# EAGLE schematic motor_shield (EAGLE 9.2.1)
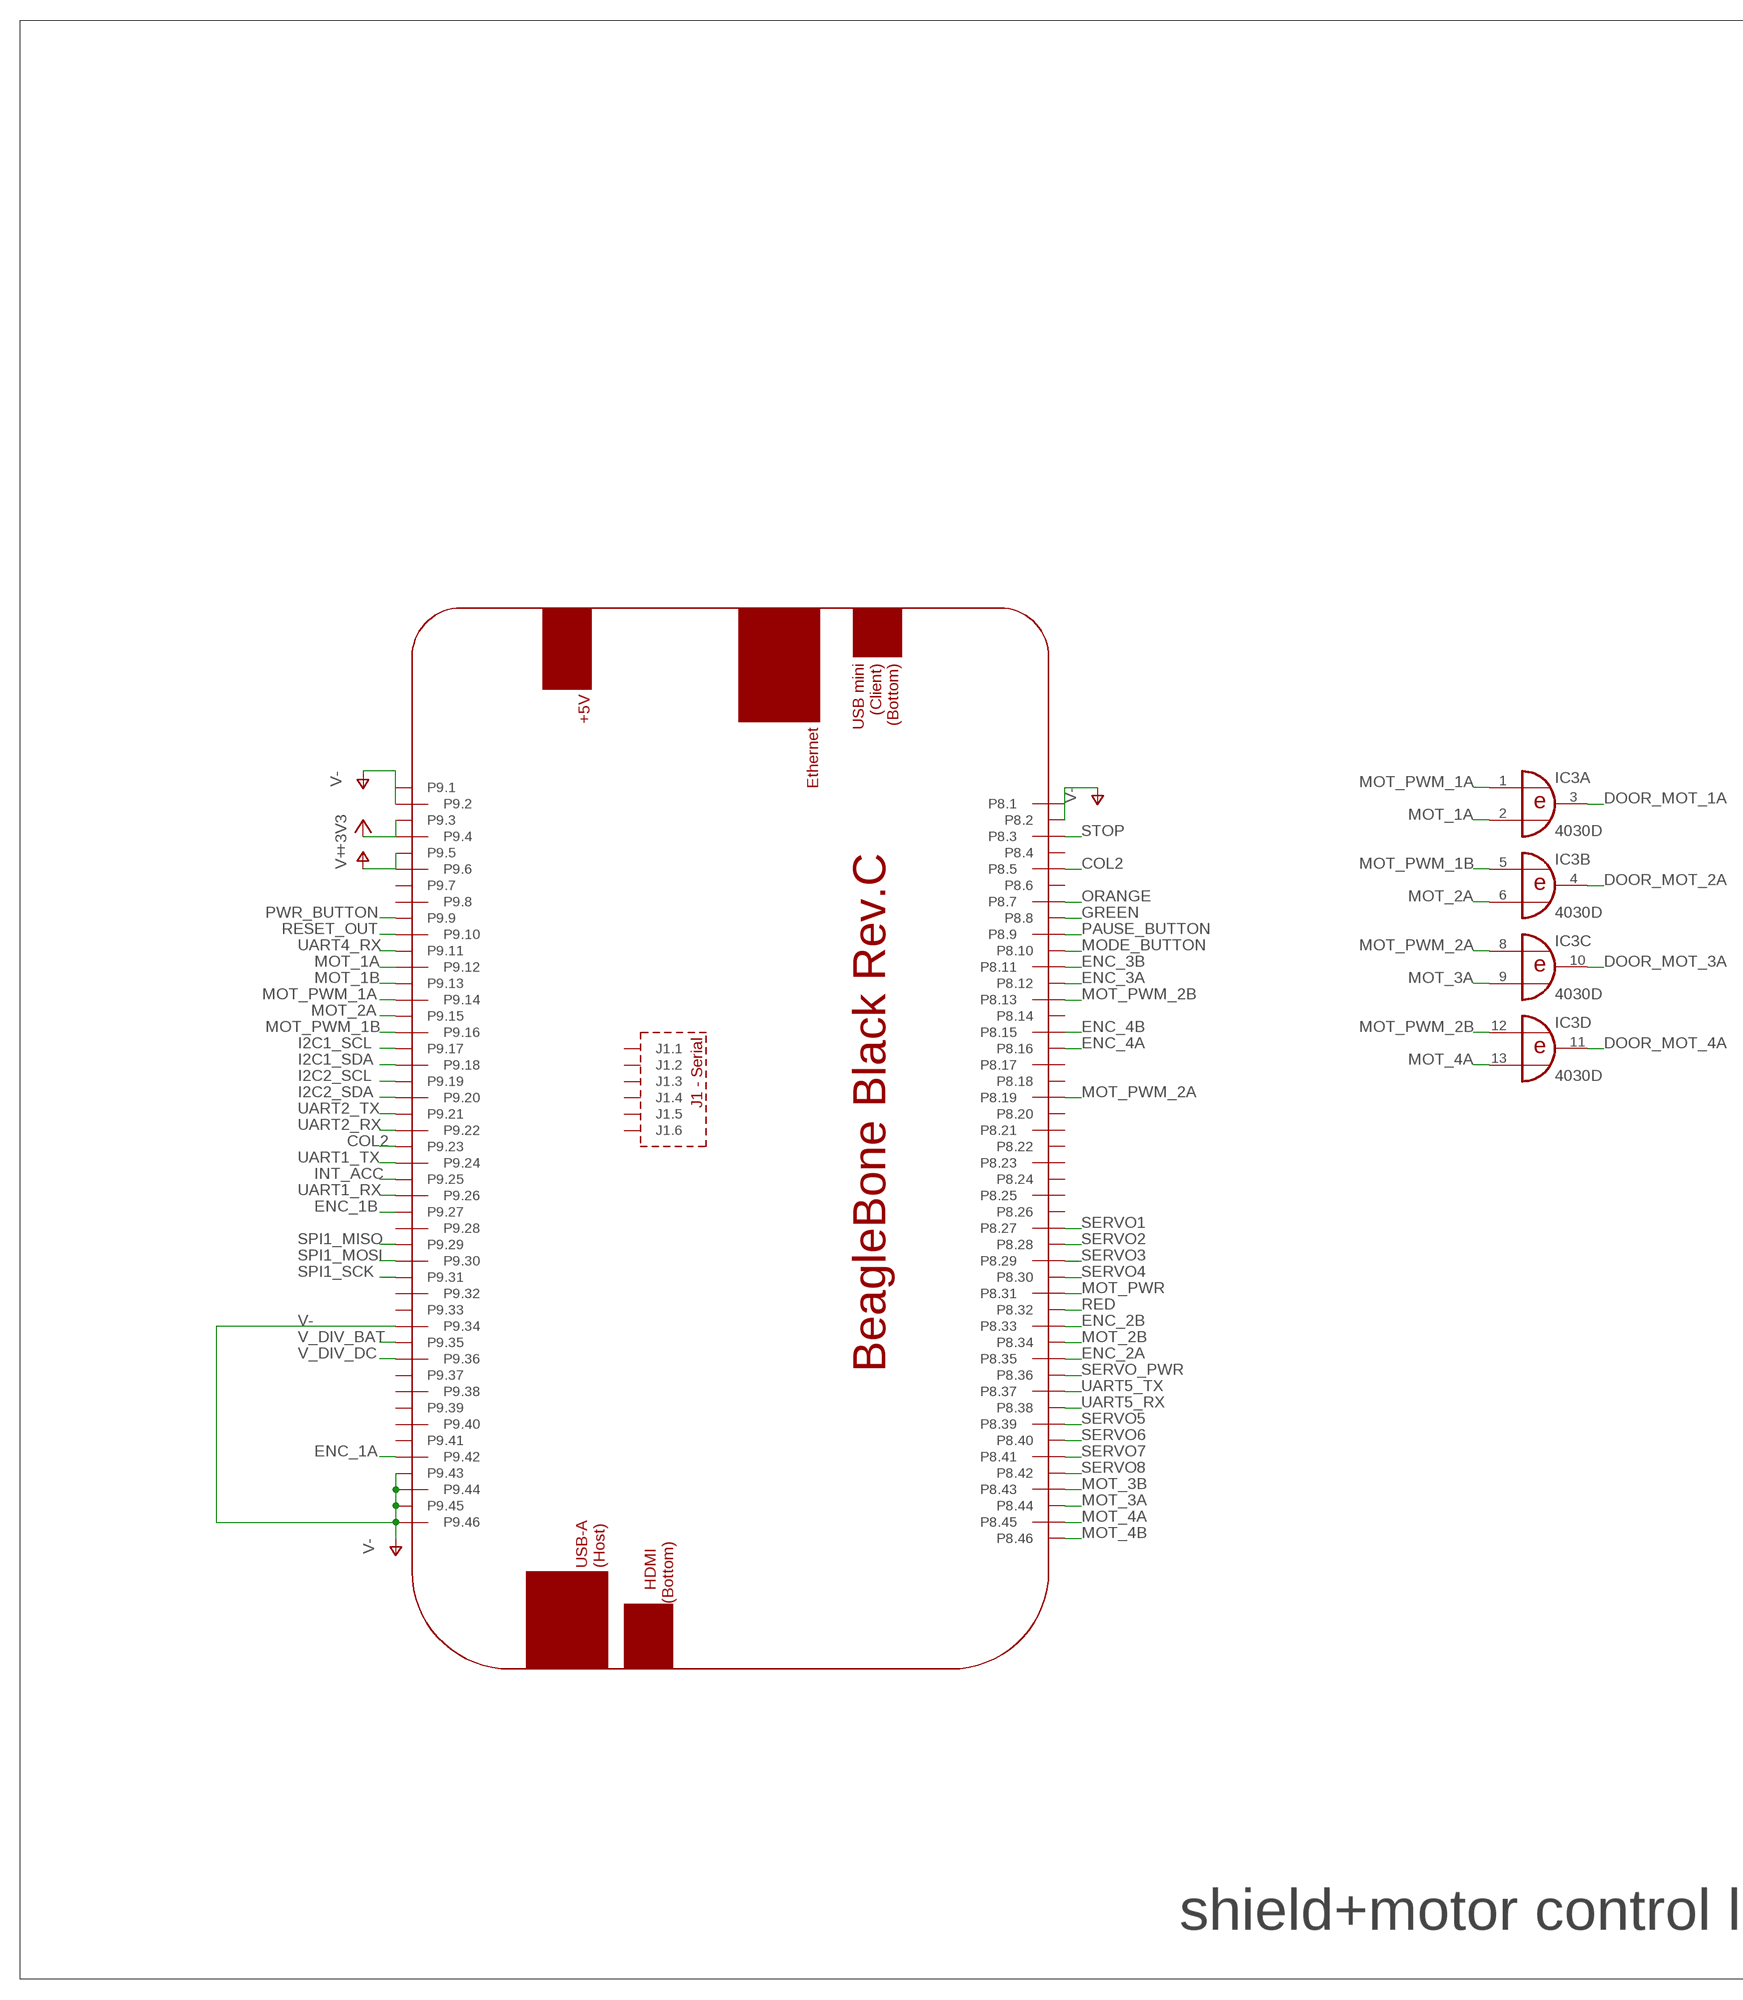
[diagram p0: schematic, sheet 1, part 1 of 3]
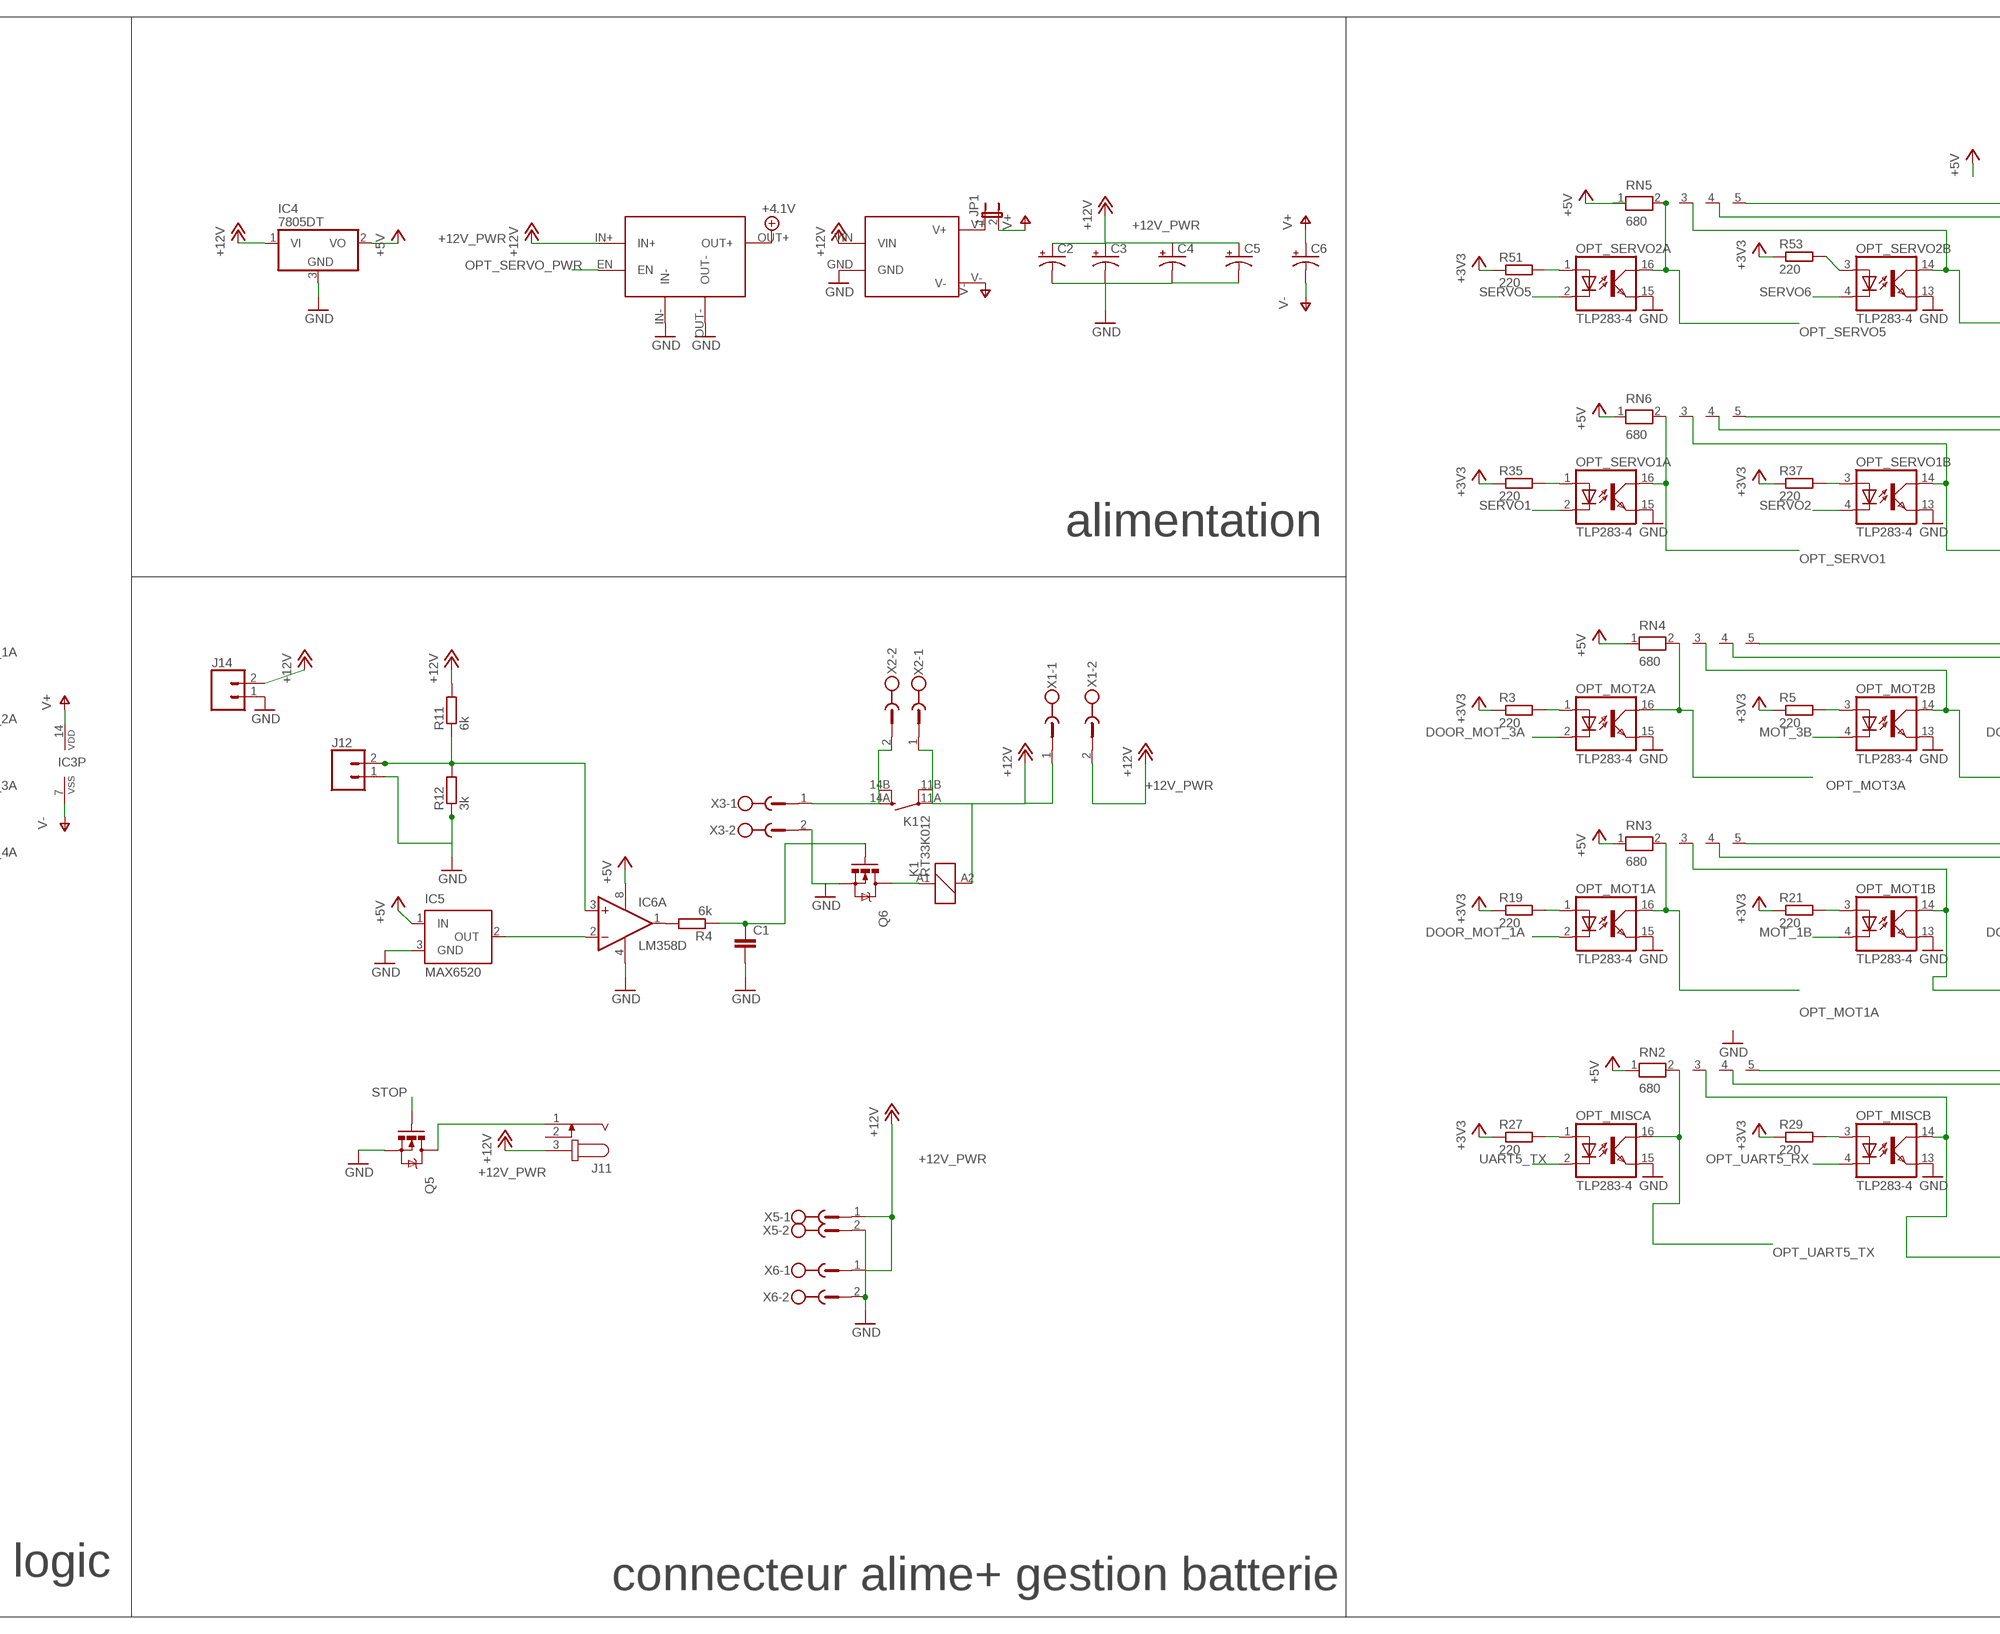
[diagram p1: schematic, sheet 1, part 2 of 3]
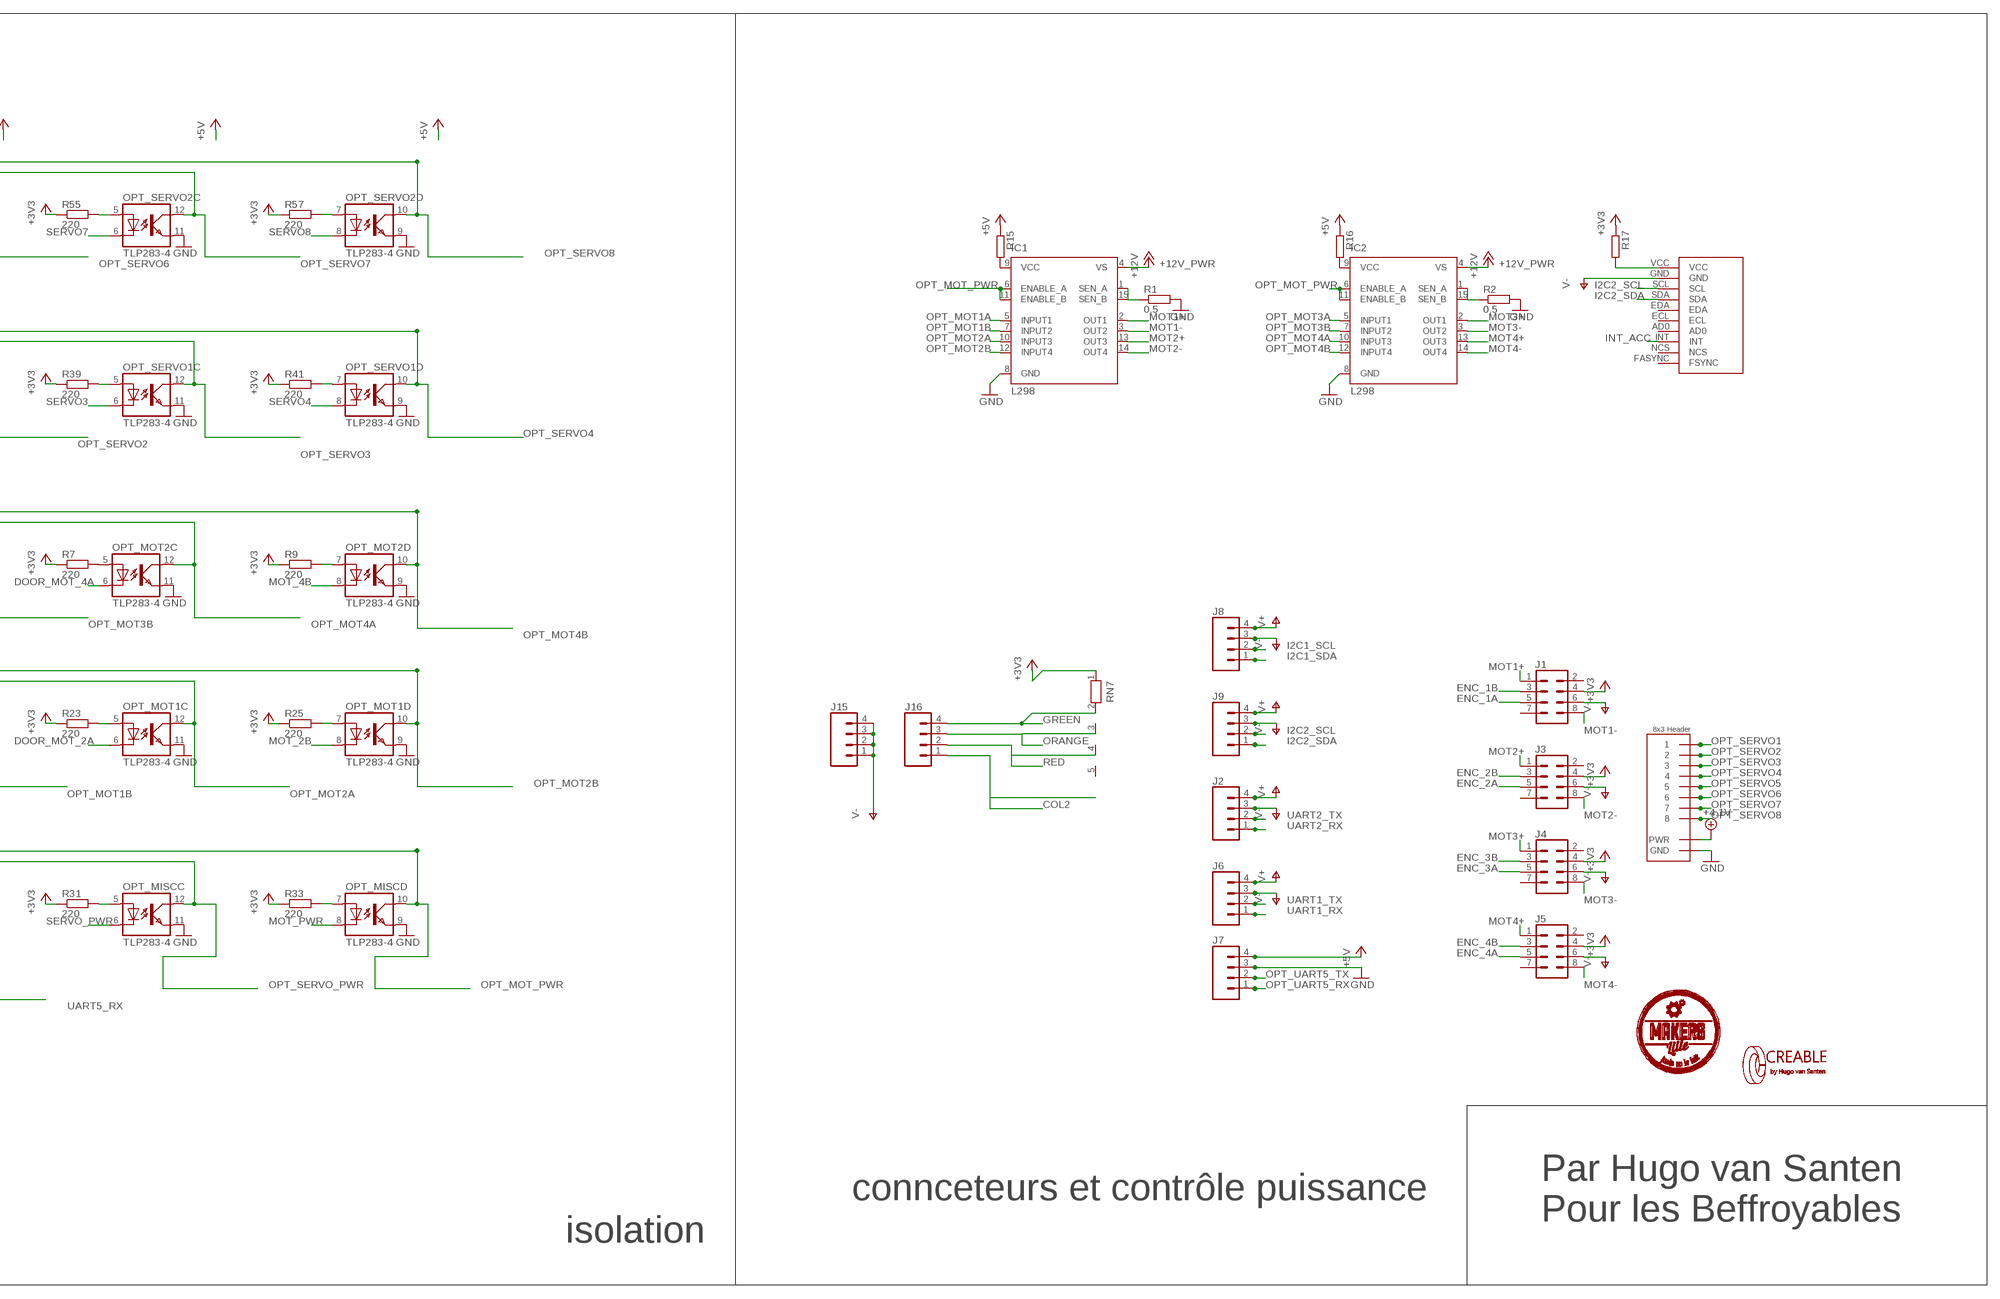
[diagram p2: schematic, sheet 1, part 3 of 3]

## Parts
C1  SPARKFUN-CAPACITORS_CAP0805  [SPARKFUN-CAPACITORS_0805]
C2  CPOL-US140CLH-1010  [ADAFRUIT_140CLH-1010]
C3  CPOL-US140CLH-1010  [ADAFRUIT_140CLH-1010]
C4  CPOL-US140CLH-1010  [ADAFRUIT_140CLH-1010]
C5  CPOL-US140CLH-1010  [ADAFRUIT_140CLH-1010]
C6  CPOL-US140CLH-1010  [ADAFRUIT_140CLH-1010]
IC1  L298  [MULTIWATT-15]
IC2  L298  [MULTIWATT-15]
IC3  4030D  [SO14]
IC4  7805DT  [TO252]
IC5  MAX6520  [SOT23]
IC6  LM358D  [SO08]
J1  CONN_04X2  [2X4]
J2  CONN_04POLAR  [MOLEX-1X4]
J3  CONN_04X2  [2X4]
J4  CONN_04X2  [2X4]
J5  CONN_04X2  [2X4]
J6  CONN_04POLAR  [MOLEX-1X4]
J7  CONN_04POLAR  [MOLEX-1X4]
J8  CONN_04POLAR  [MOLEX-1X4]
J9  CONN_04POLAR  [MOLEX-1X4]
J11  JACK-PLUG1  [SPC4078]
J12  CONN_02POLAR_LOCK  [MOLEX-1X2_LOCK]
J14  CONN_02POLAR_LOCK  [MOLEX-1X2_LOCK]
J15  CONN_04  [1X04]
J16  CONN_04  [1X04]
JP1  JP1E  [JP1]
K1  RT33K012  [RT-N/O16A5]
OPT_MISC  TLP283-4  [MINI-FLAT-16]
OPT_MOT1  TLP283-4  [MINI-FLAT-16]
OPT_MOT2  TLP283-4  [MINI-FLAT-16]
OPT_SERVO1  TLP283-4  [MINI-FLAT-16]
OPT_SERVO2  TLP283-4  [MINI-FLAT-16]
PCB1  BEAGLEBONE_BLACK_CAPE  [BEAGLEBONE_BLACK_CAPE]
Q5  STRAWSON_EAGLE_LIB_MOSFET-NCHANNEL  [STRAWSON_EAGLE_LIB_SO08-TIGHT]
Q6  STRAWSON_EAGLE_LIB_MOSFET-NCHANNEL  [STRAWSON_EAGLE_LIB_SO08-TIGHT]
R1  0.5  R-EU_M0805  [M0805]
R2  0.5  R-EU_M0805  [M0805]
R3  220  R-EU_M0805  [M0805]
R4  6k  R-EU_M0805  [M0805]
R5  220  R-EU_M0805  [M0805]
R7  220  R-EU_M0805  [M0805]
R9  220  R-EU_M0805  [M0805]
R11  6k  R-EU_M0805  [M0805]
R12  3k  R-EU_M0805  [M0805]
R15  R-EU_R0402  [R0402]
R16  R-EU_R0402  [R0402]
R17  R-EU_R0402  [R0402]
R19  220  R-EU_M0805  [M0805]
R21  220  R-EU_M0805  [M0805]
R23  220  R-EU_M0805  [M0805]
R25  220  R-EU_M0805  [M0805]
R27  220  R-EU_M0805  [M0805]
R29  220  R-EU_M0805  [M0805]
R31  220  R-EU_M0805  [M0805]
R33  220  R-EU_M0805  [M0805]
R35  220  R-EU_M0805  [M0805]
R37  220  R-EU_M0805  [M0805]
R39  220  R-EU_M0805  [M0805]
R41  220  R-EU_M0805  [M0805]
R51  220  R-EU_M0805  [M0805]
R53  220  R-EU_M0805  [M0805]
R55  220  R-EU_M0805  [M0805]
R57  220  R-EU_M0805  [M0805]
RN2  680  RN04  [RN-5]
RN3  680  RN04  [RN-5]
RN4  680  RN04  [RN-5]
RN5  680  RN04  [RN-5]
RN6  680  RN04  [RN-5]
RN7  RN04  [RN-5]
U$1  WRA-YMD  [WRA-YMD]
U$2  MPU9220  [MPU9250]
U$3  LOGO  [LOGO]
U$4  STRAWSON_EAGLE_LIB_SERVO_HEADERS_8X  [STRAWSON_EAGLE_LIB_3X8_0.1"_HEADER]
U$5  XL6009  [XL6009]
U$6  LOGO_MAKERS  [LOGO_MAKERS]
X1  MSTBV2  [MSTBV2]
X2  MSTBV2  [MSTBV2]
X3  MSTBV2  [MSTBV2]
X5  MSTBV2  [MSTBV2]
X6  MSTBV2  [MSTBV2]

## Nets
+3V3: J1.4 J3.4 J4.4 J5.4 PCB1.P9.3 PCB1.P9.4 R3.1 R5.1 R7.1 R9.1 R17.1 R19.1 R21.1 R23.1 R25.1 R27.1 R29.1 R31.1 R33.1 R35.1 R37.1 R39.1 R41.1 R51.1 R53.1 R55.1 R57.1 RN7.1
+4.1V: U$4.P$7(PWR) U$4.P$8(PWR) U$4.P$9(PWR) U$4.P$10(PWR) U$4.P$11(PWR) U$4.P$12(PWR) U$4.P$21(PWR) U$4.P$22(PWR) U$5.OUT+
+5V: IC4.2(VO) IC5.1(IN) IC6.8(P:V+) J7.4 R15.1 R16.1 RN2.1 RN3.1 RN4.1 RN5.1 RN6.1
+12V: IC4.1(VI) J14.2 K1.11A(2:PA) K1.11B(2:PB) K1.A2 R11.2 U$1.VIN X1.1 X2.1
+12V_PWR: C2.+ C3.+ C4.+ C5.+ IC1.4(VS) IC2.4(VS) J11.3 U$5.IN+ X1.2 X5.1 X6.1 ; supply symbol labelled +12V
COL2: J16.1 PCB1.P8.5 PCB1.P9.23
DOOR_MOT_1A: IC3.3(A:O) OPT_MOT1.2(A:C)
DOOR_MOT_2A: IC3.4(B:O) OPT_MOT1.6(C:C)
DOOR_MOT_3A: IC3.10(C:O) OPT_MOT2.2(A:C)
DOOR_MOT_4A: IC3.11(D:O) OPT_MOT2.6(C:C)
ENC_1A: J1.5 PCB1.P9.42
ENC_1B: J1.3 PCB1.P9.27
ENC_2A: J3.5 PCB1.P8.35
ENC_2B: J3.3 PCB1.P8.33
ENC_3A: J4.5 PCB1.P8.12
ENC_3B: J4.3 PCB1.P8.11
ENC_4A: J5.5 PCB1.P8.16
ENC_4B: J5.3 PCB1.P8.15
GND: C1.2 C2.- C3.- C4.- C5.- IC1.8(GND) IC2.8(GND) IC4.3(GND) IC5.3(GND) IC6.4(P:V-) J7.3 J12.1 J14.1 OPT_MISC.9(D:EMIT) OPT_MISC.11(C:EMIT) OPT_MISC.13(B:EMIT) OPT_MISC.15(A:EMIT) OPT_MOT1.9(D:EMIT) OPT_MOT1.11(C:EMIT) OPT_MOT1.13(B:EMIT) OPT_MOT1.15(A:EMIT) OPT_MOT2.9(D:EMIT) OPT_MOT2.11(C:EMIT) OPT_MOT2.13(B:EMIT) OPT_MOT2.15(A:EMIT) OPT_SERVO1.9(D:EMIT) OPT_SERVO1.11(C:EMIT) OPT_SERVO1.13(B:EMIT) OPT_SERVO1.15(A:EMIT) OPT_SERVO2.9(D:EMIT) OPT_SERVO2.11(C:EMIT) OPT_SERVO2.13(B:EMIT) OPT_SERVO2.15(A:EMIT) Q5.1(S) Q5.2(S) Q5.3(S) Q6.1(S) Q6.2(S) Q6.3(S) R1.2 R2.2 R12.1 U$1.GND U$4.P$13(GND) U$4.P$14(GND) U$4.P$15(GND) U$4.P$16(GND) U$4.P$17(GND) U$4.P$18(GND) U$4.P$23(GND) U$4.P$24(GND) U$5.IN- U$5.OUT- X3.2 X5.2 X6.2
GREEN: J16.4 PCB1.P8.8 RN7.2
I2C1_SCL: J8.2 PCB1.P9.17
I2C1_SDA: J8.1 PCB1.P9.18
I2C2_SCL: J9.2 PCB1.P9.19 U$2.SCL
I2C2_SDA: J9.1 PCB1.P9.20 U$2.SDA
INT_ACC: PCB1.P9.25 U$2.INT
MODE_BUTTON: PCB1.P8.10
MOT1+: IC1.2(OUT1) J1.1
MOT1-: IC1.3(OUT2) J1.8
MOT2+: IC1.13(OUT3) J3.1
MOT2-: IC1.14(OUT4) J3.8
MOT3+: IC2.2(OUT1) J4.1
MOT3-: IC2.3(OUT2) J4.8
MOT4+: IC2.13(OUT3) J5.1
MOT4-: IC2.14(OUT4) J5.8
MOT_1A: IC3.2(A:I1) PCB1.P9.12
MOT_1B: OPT_MOT1.4(B:C) PCB1.P9.13
MOT_2A: IC3.6(B:I1) PCB1.P9.15
MOT_2B: OPT_MOT1.8(D:C) PCB1.P8.34
MOT_3A: IC3.9(C:I1) PCB1.P8.44
MOT_3B: OPT_MOT2.4(B:C) PCB1.P8.43
MOT_4A: IC3.13(D:I1) PCB1.P8.45
MOT_4B: OPT_MOT2.8(D:C) PCB1.P8.46
MOT_PWM_1A: IC3.1(A:I0) PCB1.P9.14
MOT_PWM_1B: IC3.5(B:I0) PCB1.P9.16
MOT_PWM_2A: IC3.8(C:I0) PCB1.P8.19
MOT_PWM_2B: IC3.12(D:I0) PCB1.P8.13
MOT_PWR: OPT_MISC.8(D:C) PCB1.P8.31
N$1: OPT_SERVO2.1(A:A) R51.2
N$2: OPT_SERVO2.3(B:A) R53.2
N$3: OPT_MISC.1(A:A) R27.2
N$5: IC1.1(SEN_A) IC1.15(SEN_B) R1.1
N$6: IC2.1(SEN_A) IC2.15(SEN_B) R2.1
N$7: OPT_SERVO2.7(D:A) R57.2
N$8: OPT_SERVO1.1(A:A) R35.2
N$9: OPT_MOT2.5(C:A) R7.2
N$10: J11.1 Q5.5(D) Q5.6(D) Q5.7(D) Q5.8(D)
N$11: OPT_SERVO1.3(B:A) R37.2
N$12: OPT_SERVO1.7(D:A) R41.2
N$13: OPT_MOT2.1(A:A) R3.2
N$14: OPT_MOT2.3(B:A) R5.2
N$15: OPT_MOT2.7(D:A) R9.2
N$16: OPT_MOT1.3(B:A) R21.2
N$17: OPT_MOT1.1(A:A) R19.2
N$18: OPT_MOT1.7(D:A) R25.2
N$26: OPT_MOT1.5(C:A) R23.2
N$42: OPT_SERVO1.5(C:A) R39.2
N$51: OPT_MISC.3(B:A) R29.2
N$52: OPT_MISC.7(D:A) R33.2
N$58: OPT_SERVO2.5(C:A) R55.2
N$64: IC5.2(OUT) IC6.2(A:-IN)
N$69: OPT_MISC.5(C:A) R31.2
N$73: IC6.1(A:OUT) R4.2
N$74: K1.14A(2:SA) K1.14B(2:SB) X2.2 X3.1
N$75: K1.A1 Q6.5(D) Q6.6(D) Q6.7(D) Q6.8(D)
N$76: IC6.3(A:+IN) J12.2 R11.1 R12.2
N$77: C1.1 Q6.4(G) R4.1
N$78: JP1.1 U$1.V+
N$84: IC1.9(VCC) R15.2
N$85: IC2.9(VCC) R16.2
N$86: R17.2 U$2.VCC
OPT_MOT1A: IC1.5(INPUT1) OPT_MOT1.16(A:COL) RN3.2
OPT_MOT1B: IC1.7(INPUT2) OPT_MOT1.14(B:COL) RN3.3
OPT_MOT2A: IC1.10(INPUT3) OPT_MOT1.12(C:COL) RN3.4
OPT_MOT2B: IC1.12(INPUT4) OPT_MOT1.10(D:COL) RN3.5
OPT_MOT3A: IC2.5(INPUT1) OPT_MOT2.16(A:COL) RN4.2
OPT_MOT3B: IC2.7(INPUT2) OPT_MOT2.14(B:COL) RN4.3
OPT_MOT4A: IC2.10(INPUT3) OPT_MOT2.12(C:COL) RN4.4
OPT_MOT4B: IC2.12(INPUT4) OPT_MOT2.10(D:COL) RN4.5
OPT_MOT_PWR: IC1.6(ENABLE_A) IC1.11(ENABLE_B) IC2.6(ENABLE_A) IC2.11(ENABLE_B) OPT_MISC.10(D:COL) RN2.5
OPT_SERVO1: OPT_SERVO1.16(A:COL) RN6.2 U$4.P$1
OPT_SERVO2: OPT_SERVO1.14(B:COL) RN6.3 U$4.P$2
OPT_SERVO3: OPT_SERVO1.12(C:COL) RN6.4 U$4.P$3
OPT_SERVO4: OPT_SERVO1.10(D:COL) RN6.5 U$4.P$4
OPT_SERVO5: OPT_SERVO2.16(A:COL) RN5.2 U$4.P$5
OPT_SERVO6: OPT_SERVO2.14(B:COL) RN5.3 U$4.P$6
OPT_SERVO7: OPT_SERVO2.12(C:COL) RN5.4 U$4.P$19
OPT_SERVO8: OPT_SERVO2.10(D:COL) RN5.5 U$4.P$20
OPT_SERVO_PWR: OPT_MISC.12(C:COL) RN2.4 U$5.EN
OPT_UART5_RX: J7.1 OPT_MISC.4(B:C)
OPT_UART5_TX: J7.2 OPT_MISC.16(A:COL) RN2.2
ORANGE: J16.3 PCB1.P8.7 RN7.3
PAUSE_BUTTON: PCB1.P8.9
PWR_BUTTON: PCB1.P9.9
RED: J16.2 PCB1.P8.32 RN7.4
RESET_OUT: PCB1.P9.10
SERVO1: OPT_SERVO1.2(A:C) PCB1.P8.27
SERVO2: OPT_SERVO1.4(B:C) PCB1.P8.28
SERVO3: OPT_SERVO1.6(C:C) PCB1.P8.29
SERVO4: OPT_SERVO1.8(D:C) PCB1.P8.30
SERVO5: OPT_SERVO2.2(A:C) PCB1.P8.39
SERVO6: OPT_SERVO2.4(B:C) PCB1.P8.40
SERVO7: OPT_SERVO2.6(C:C) PCB1.P8.41
SERVO8: OPT_SERVO2.8(D:C) PCB1.P8.42
SERVO_PWR: OPT_MISC.6(C:C) PCB1.P8.36
SPI1_MISO: PCB1.P9.29
SPI1_MOSI: PCB1.P9.30
SPI1_SCK: PCB1.P9.31
STOP: PCB1.P8.3 Q5.4(G)
UART1_RX: J6.1 PCB1.P9.26
UART1_TX: J6.2 PCB1.P9.24
UART2_RX: J2.1 PCB1.P9.22
UART2_TX: J2.2 PCB1.P9.21
UART4_RX: PCB1.P9.11
UART5_RX: OPT_MISC.14(B:COL) PCB1.P8.38 RN2.3
UART5_TX: OPT_MISC.2(A:C) PCB1.P8.37
V+: C6.+ IC3.14(P:VDD) J2.4 J6.4 J8.4 J9.4 JP1.2 PCB1.P9.5 PCB1.P9.6
V-: C6.- IC3.7(P:VSS) J1.6 J2.3 J3.6 J4.6 J5.6 J6.3 J8.3 J9.3 J15.1 J15.2 J15.3 J15.4 PCB1.P8.1 PCB1.P8.2 PCB1.P9.1 PCB1.P9.2 PCB1.P9.34 PCB1.P9.43 PCB1.P9.44 PCB1.P9.45 PCB1.P9.46 U$1.V- U$2.GND
V_DIV_BAT: PCB1.P9.35
V_DIV_DC: PCB1.P9.36
Unconnected: IC6.5(B:+IN) IC6.6(B:-IN) IC6.7(B:OUT) J1.2 J1.7 J3.2 J3.7 J4.2 J4.7 J5.2 J5.7 J11.2 PCB1.J1.1 PCB1.J1.2 PCB1.J1.3 PCB1.J1.4 PCB1.J1.5 PCB1.J1.6 PCB1.P8.4 PCB1.P8.6 PCB1.P8.14 PCB1.P8.17 PCB1.P8.18 PCB1.P8.20 PCB1.P8.21 PCB1.P8.22 PCB1.P8.23 PCB1.P8.24 PCB1.P8.25 PCB1.P8.26 PCB1.P9.7 PCB1.P9.8 PCB1.P9.28 PCB1.P9.32 PCB1.P9.33 PCB1.P9.37 PCB1.P9.38 PCB1.P9.39 PCB1.P9.40 PCB1.P9.41 RN7.5 U$2.AD0 U$2.ECL U$2.EDA U$2.FASYNC(FSYNC) U$2.NCS

## Notes on the sheet
- alimentation
- connceteurs et contrôle puissance
- Par Hugo van Santen
  Pour les Beffroyables
- shield+motor control logic | isolation
- connecteur alime+ gestion batterie

## Library data of the parts
C1 = BeagleBone_Blue:SPARKFUN-CAPACITORS_CAP: Capacitor Standard 0603 ceramic capacitor, and 0.1" leaded capacitor.
C2-C6 = BeagleBone_Blue:CPOL-US: POLARIZED CAPACITOR, American symbol
IC1 IC2 = st-microelectronics:L298: DUAL FULL-BRIDGE DRIVER; MPN: L298N; OC_FARNELL: 1589425; OC_NEWARK: 32M1527
IC3 = 40xx:4030: Quad XOR
IC4 = linear:78*: Positive VOLTAGE REGULATOR Source: http://cache.national.com/ds/LM/LM78L05.pdf http://www.fairchildsemi.com/ds/LM/LM7805.pdf
IC5 = maxim:MAX6520: 1.2V Voltage Reference 50ppm/°C, SOT23, 3-Terminal Source: Data sheet <http://datasheets.maxim-ic.com/en/ds/MAX6520.pdf>; MF: MAXIM; MPN: MAX6520EUR-T; OC_FARNELL: unknown; OC_NEWARK: 02J4586
IC6 = linear:LM358: OP AMP also LM158; LM258; LM2904 Source: http://cache.national.com/ds/LM/LM158.pdf
J1 J3-J5 = SparkFun-Connectors:CONN_04X2: Multi connection point. Often used as Generic Header-pin footprint for 0.1 inch spaced/style header connections On any of the 0.1 inch spaced packages, you can populate with these: Break Away Headers - Straight <https://www.sparkfun.com/products/116> (PRT-00116) Break Away Male Headers - Right Angle <https://www.sparkfun.com/products/553> (PRT-00553) Female Headers <https://www.sparkfun.com/products/115> (PRT-00115) Break Away Headers - Machine Pin <https://www.sparkfun.com/products/117> (PRT-00117) Break Away Female Headers - Swiss Machine Pin <https://www.sparkfun.com/products/743> (PRT-00743)
J2 J6-J9 = SparkFun-Connectors:CONN_04: Multi connection point. Often used as Generic Header-pin footprint for 0.1 inch spaced/style header connections On any of the 0.1 inch spaced packages, you can populate with these: Break Away Headers - Straight <https://www.sparkfun.com/products/116> (PRT-00116) Break Away Male Headers - Right Angle <https://www.sparkfun.com/products/553> (PRT-00553) Female Headers <https://www.sparkfun.com/products/115> (PRT-00115) Break Away Headers - Machine Pin <https://www.sparkfun.com/products/117> (PRT-00117) Break Away Female Headers - Swiss Machine Pin <https://www.sparkfun.com/products/743> (PRT-00743) For SCREWTERMINALS and SPRING TERMINALS visit here: Screw Terimnals on SparkFun.com <https://www.sparkfun.com/search/results?term=Screw+Terminals> (5mm/3.5mm/2.54mm spacing) This device is also useful as a general connection point to wire up your design to another part of your project. Our various solder wires solder well into these plated through hole pads. Hook-Up Wire - Assortment (Stranded, 22 AWG) <https://www.sparkfun.com/products/11375> (PRT-11375) Hook-Up Wire - Assortment (Solid Core, 22 AWG) <https://www.sparkfun.com/products/11367> (PRT-11367) View the entire wire category on our website here <https://www.sparkfun.com/categories/141> Special notes: Molex polarized connector foot print use with SKU : PRT-08231 with associated crimp pins and housings. 1MM SMD Version SKU: PRT-10208; PROD_ID: CONN-08186; SF_ID: PRT-08231
J11 = con-jack:JACK-PLUG: DC POWER JACK Power Jack, DC, Right Angle, Through Hole, Rated 5A at 16VDC, PC Terminals Distributor: Farnell (www.Farnell.de) Drawing: 84N1161.pdf / 84N1162.pdf Manufacturer: SPC Technology (www.spctechnology.com) Type: SPC4077 / SPC 4078; OC_FARNELL: unknown; OC_NEWARK: unknown
J12 J14 = SparkFun-Connectors:CONN_02: Multi connection point. Often used as Generic Header-pin footprint for 0.1 inch spaced/style header connections On any of the 0.1 inch spaced packages, you can populate with these: Break Away Headers - Straight <https://www.sparkfun.com/products/116> (PRT-00116) Break Away Male Headers - Right Angle <https://www.sparkfun.com/products/553> (PRT-00553) Female Headers <https://www.sparkfun.com/products/115> (PRT-00115) Break Away Headers - Machine Pin <https://www.sparkfun.com/products/117> (PRT-00117) Break Away Female Headers - Swiss Machine Pin <https://www.sparkfun.com/products/743> (PRT-00743) For SCREWTERMINALS and SPRING TERMINALS visit here: Screw Terimnals on SparkFun.com <https://www.sparkfun.com/search/results?term=Screw+Terminals> (5mm/3.5mm/2.54mm spacing) This device is also useful as a general connection point to wire up your design to another part of your project. Our various solder wires solder well into these plated through hole pads. Hook-Up Wire - Assortment (Stranded, 22 AWG) <https://www.sparkfun.com/products/11375> (PRT-11375) Hook-Up Wire - Assortment (Solid Core, 22 AWG) <https://www.sparkfun.com/products/11367> (PRT-11367) View the entire wire category on our website here <https://www.sparkfun.com/categories/141> Special notes: Molex polarized connector foot print use with: PRT-08233 with associated crimp pins and housings. 2.54_SCREWTERM for use with PRT-10571. 3.5mm Screw Terminal footprints for PRT-08084 5mm Screw Terminal footprints for use with PRT-08432; SF_ID: PRT-09918
J15 J16 = SparkFun-Connectors:CONN_04: Multi connection point. Often used as Generic Header-pin footprint for 0.1 inch spaced/style header connections On any of the 0.1 inch spaced packages, you can populate with these: Break Away Headers - Straight <https://www.sparkfun.com/products/116> (PRT-00116) Break Away Male Headers - Right Angle <https://www.sparkfun.com/products/553> (PRT-00553) Female Headers <https://www.sparkfun.com/products/115> (PRT-00115) Break Away Headers - Machine Pin <https://www.sparkfun.com/products/117> (PRT-00117) Break Away Female Headers - Swiss Machine Pin <https://www.sparkfun.com/products/743> (PRT-00743) For SCREWTERMINALS and SPRING TERMINALS visit here: Screw Terimnals on SparkFun.com <https://www.sparkfun.com/search/results?term=Screw+Terminals> (5mm/3.5mm/2.54mm spacing) This device is also useful as a general connection point to wire up your design to another part of your project. Our various solder wires solder well into these plated through hole pads. Hook-Up Wire - Assortment (Stranded, 22 AWG) <https://www.sparkfun.com/products/11375> (PRT-11375) Hook-Up Wire - Assortment (Solid Core, 22 AWG) <https://www.sparkfun.com/products/11367> (PRT-11367) View the entire wire category on our website here <https://www.sparkfun.com/categories/141> Special notes: Molex polarized connector foot print use with SKU : PRT-08231 with associated crimp pins and housings. 1MM SMD Version SKU: PRT-10208; PROD_ID: CONN-09696
JP1 = jumper:JP1E: JUMPER
K1 = relay:RT33*: Power PCB Relay Inrush SCHRACK 1 pole 16 A, for inrush peak currents up to 80 A Source: http://www.schrack.com/.. 5825.pdf; MPN: RT33K012; OC_FARNELL: unknown; OC_NEWARK: 48M7964
OPT_MISC OPT_MOT1 OPT_MOT2 OPT_SERVO1 OPT_SERVO2 = optocoupler:TLP283-4: TOSHIBA PHOTOCOUPLER GaAs IRED & PHOTO-TRANSISTOR Source: http://www.semicon.toshiba.co.jp/td/en/Opto/Photocoupler/en_20050928_TLP283_datasheet.pdf; OC_FARNELL: unknown; OC_NEWARK: unknown
PCB1 = e14_BeagleBoneBlack_RevB:BEAGLEBONE_BLACK_CAPE
Q5 Q6 = BeagleBone_Blue:STRAWSON_EAGLE_LIB_MOSFET-NCHANNEL: Common NMOSFET Parts MFG P/N Store ID Prod ID FDD8780 TRANS-09984 SI7820DN TRANS-11055 FDS6630A IC-08089 2N7002PW TRANS-11151 FQP30N06L COM-10213 TRANS-10060 BSS123LT1G TRANS-08345 BSS138 TRANS-00830 BS170 2N7000
R1-R5 R7 R9 R11 R12 R19 R21 R23 R25 R27 R29 R31 R33 R35 R37 R39 R41 R51 R53 R55 R57 = rcl:R-EU_: RESISTOR, European symbol; SPICEPREFIX: R
R15-R17 = resistor:R-EU_: RESISTOR, European symbol
RN2-RN7 = resistor-net:RN04: RESISTOR NETWORK; OC_FARNELL: unknown; OC_NEWARK: unknown
U$1 = beffroyables:WRA-YMD
U$2 = beffroyables:MPU9220
U$3 = beffroyables:LOGO
U$4 = BeagleBone_Blue:STRAWSON_EAGLE_LIB_SERVO_HEADERS_8X
U$5 = beffroyables:XL6009
U$6 = beffroyables:LOGO_MAKERS
X1-X3 X5 X6 = con-phoenix-500:MSTBV2: PHOENIX; OC_FARNELL: unknown; OC_NEWARK: unknown